# EAGLE design Color sensor_LED Board (EAGLE 9.6.2)
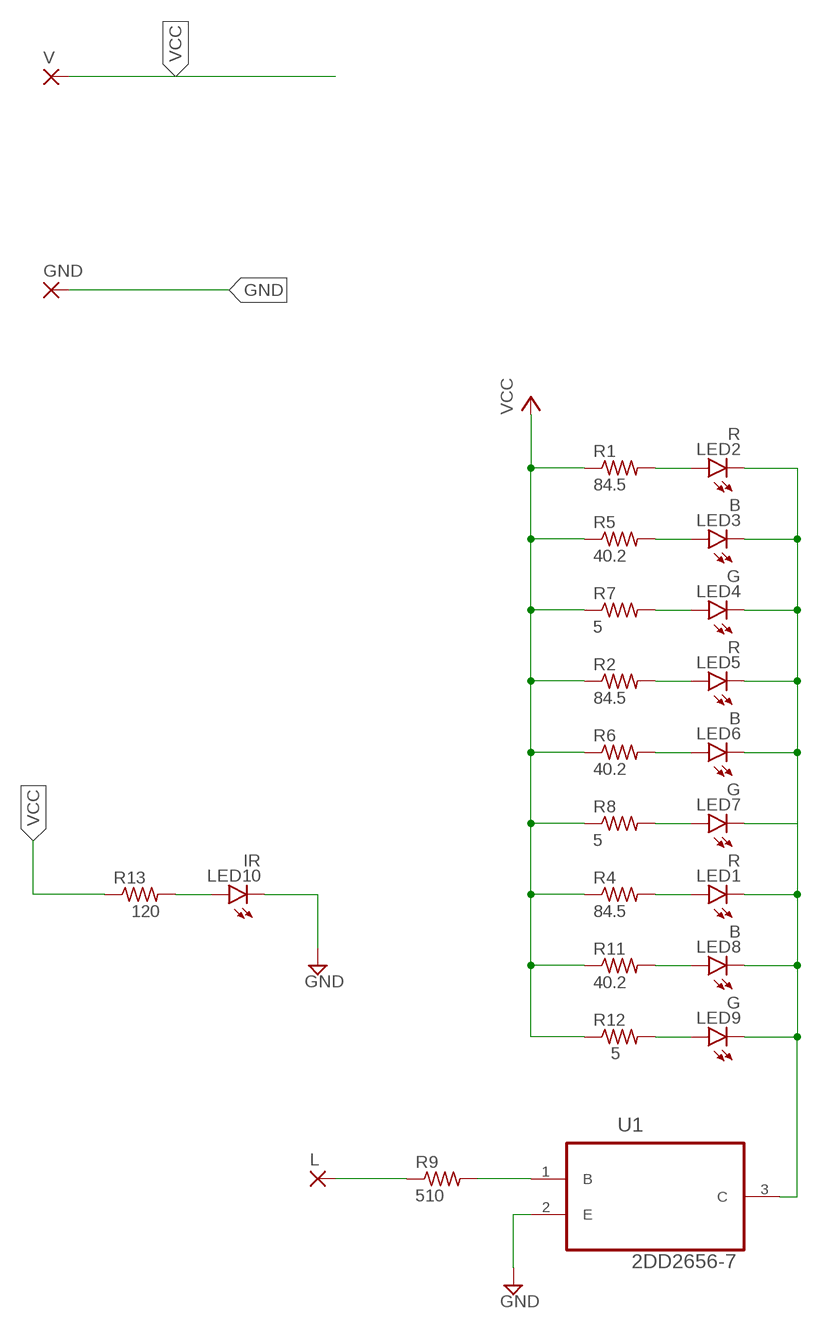
[diagram p0: schematic, sheet 1]

## Parts
GND  SMD2  [SMD1,27-2,54]
L  SMD2  [SMD1,27-2,54]
LED1  R  LEDCHIPLED_0805  [CHIPLED_0805]
LED2  R  LEDCHIPLED_0805  [CHIPLED_0805]
LED3  B  LEDCHIPLED_0805  [CHIPLED_0805]
LED4  G  LEDCHIPLED_0805  [CHIPLED_0805]
LED5  R  LEDCHIPLED_0805  [CHIPLED_0805]
LED6  B  LEDCHIPLED_0805  [CHIPLED_0805]
LED7  G  LEDCHIPLED_0805  [CHIPLED_0805]
LED8  B  LEDCHIPLED_0805  [CHIPLED_0805]
LED9  G  LEDCHIPLED_0805  [CHIPLED_0805]
LED10  IR  LEDCHIPLED_0805  [CHIPLED_0805]
R1  84.5  R-US_R0805  [R0805]
R2  84.5  R-US_R0805  [R0805]
R4  84.5  R-US_R0805  [R0805]
R5  40.2  R-US_R0805  [R0805]
R6  40.2  R-US_R0805  [R0805]
R7  5  R-US_R0805  [R0805]
R8  5  R-US_R0805  [R0805]
R9  510  R-US_R0805  [R0805]
R11  40.2  R-US_R0805  [R0805]
R12  5  R-US_R0805  [R0805]
R13  120  R-US_R0805  [R0805]
U1  2DD2656-7  [SOT65P210X110-3N]
V  SMD2  [SMD1,27-2,54]

## Nets
GND: GND.1(P) LED10.C U1.2(E)
N$2: R9.2 U1.1(B)
N$4: L.1(P) R9.1
N$6: LED2.A R1.2
N$7: LED3.A R5.2
N$8: LED4.A R7.2
N$9: LED5.A R2.2
N$10: LED6.A R6.2
N$11: LED7.A R8.2
N$12: LED1.A R4.2
N$13: LED8.A R11.2
N$14: LED9.A R12.2
N$15: LED1.C LED2.C LED3.C LED4.C LED5.C LED6.C LED7.C LED8.C LED9.C U1.3(C)
N$17: LED10.A R13.2
VCC: R1.1 R2.1 R4.1 R5.1 R6.1 R7.1 R8.1 R11.1 R12.1 R13.1 V.1(P)

## Library data of the parts
GND L V = wirepad:SMD2: SMD PAD
LED1-LED10 = led:LED: LED OSRAM: - CHIPLED LG R971, LG N971, LY N971, LG Q971, LY Q971, LO R971, LY R971 LH N974, LH R974 LS Q976, LO Q976, LY Q976 LO Q996 - Hyper CHIPLED LW Q18S LB Q993, LB Q99A, LB R99A - SideLED LS A670, LO A670, LY A670, LG A670, LP A670 LB A673, LV A673, LT A673, LW A673 LH A674 LY A675 LS A676, LA A676, LO A676, LY A676, LW A676 LS A679, LY A679, LG A679 - Hyper Micro SIDELED® LS Y876, LA Y876, LO Y876, LY Y876 LT Y87S - SmartLED LW L88C, LW L88S LB L89C, LB L89S, LG L890 LS L89K, LO L89K, LY L89K LS L896, LA L896, LO L896, LY L896 - TOPLED LS T670, LO T670, LY T670, LG T670, LP T670 LSG T670, LSP T670, LSY T670, LOP T670, LYG T670 LG T671, LOG T671, LSG T671 LB T673, LV T673, LT T673, LW T673 LH T674 LS T676, LA T676, LO T676, LY T676, LB T676, LH T676, LSB T676, LW T676 LB T67C, LV T67C, LT T67C, LS T67K, LO T67K, LY T67K, LW E67C LS E67B, LA E67B, LO E67B, LY E67B, LB E67C, LV E67C, LT E67C LW T67C LS T679, LY T679, LG T679 LS T770, LO T770, LY T770, LG T770, LP T770 LB T773, LV T773, LT T773, LW T773 LH T774 LS E675, LA E675, LY E675, LS T675 LS T776, LA T776, LO T776, LY T776, LB T776 LHGB T686 LT T68C, LB T68C - Hyper Mini TOPLED® LB M676 - Mini TOPLED Santana® LG M470 LS M47K, LO M47K, LY M47K Source: http://www.osram.convergy.de LUXEON: - LUMILED® LXK2-PW12-R00, LXK2-PW12-S00, LXK2-PW14-U00, LXK2-PW14-V00 LXK2-PM12-R00, LXK2-PM12-S00, LXK2-PM14-U00 LXK2-PE12-Q00, LXK2-PE12-R00, LXK2-PE12-S00, LXK2-PE14-T00, LXK2-PE14-U00 LXK2-PB12-K00, LXK2-PB12-L00, LXK2-PB12-M00, LXK2-PB14-N00, LXK2-PB14-P00, LXK2-PB14-Q00 LXK2-PR12-L00, LXK2-PR12-M00, LXK2-PR14-Q00, LXK2-PR14-R00 LXK2-PD12-Q00, LXK2-PD12-R00, LXK2-PD12-S00 LXK2-PH12-R00, LXK2-PH12-S00 LXK2-PL12-P00, LXK2-PL12-Q00, LXK2-PL12-R00 Source: www.luxeon.com KINGBRIGHT: KA-3528ASYC Source: www.kingbright.com
R1 R2 R4-R9 R11-R13 = rcl:R-US_: RESISTOR, American symbol; SPICEPREFIX: R
U1 = 2DD2656-7 (1):2DD2656-7: N-CHANNEL ENHANCEMENT MODE MOSFET Check prices <https://pricing.snapeda.com/parts/2DD2656-7/Diodes%20Zetex/view-part?ref=eda>; AVAILABILITY: Not in stock; DESCRIPTION: Trans GP BJT NPN 30V 1A 500mW 3-Pin SOT-323 T/R; MF: Diodes Zetex; MP: 2DD2656-7; PACKAGE: None; PRICE: None

## Board
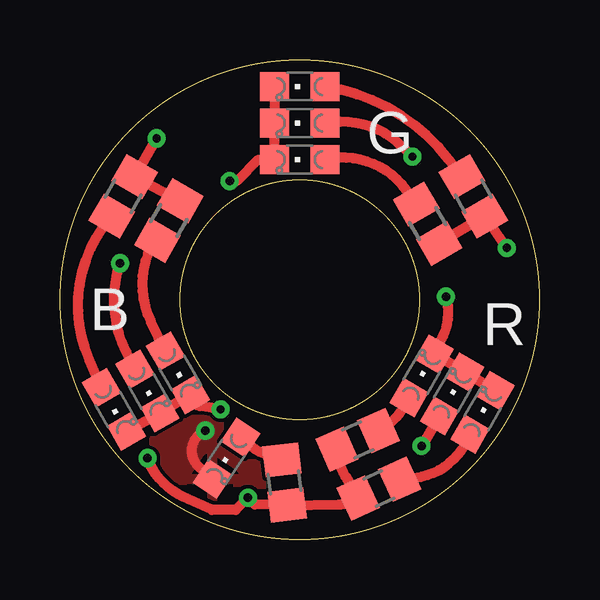
[diagram p1: board, top side]
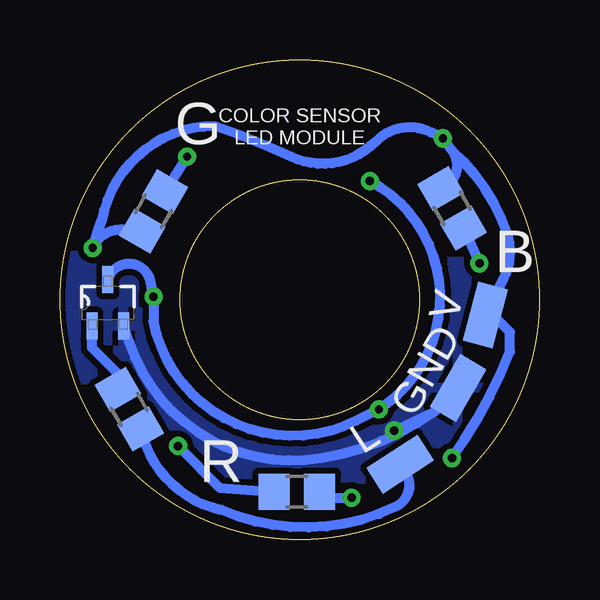
[diagram p2: board, bottom side, seen from below]

Size 20 x 20 mm. Coordinates in mm from the lower left corner, seen from the top.
Outline: circle at 10,10 radius 5
Outline: circle at 10,10 radius 10
Copper layers (1*16): Top 0.035mm / dielectric 1.5mm / Bottom 0.035mm
Design rules "default *": minimum track width 6mil, minimum drill 0.35mm, track to track 6mil, track to pad 8mil, pad to pad 6mil, via to via 10mil, smd to smd 6mil, copper to edge 8mil, drill to drill 6mil, minimum pad ring 10mil, minimum via ring 8mil, stop-mask expansion 4mil, vias tented up to drill 0mil, thermal gap 10mil

### Footprints (pad centres in the part's own frame; a part is rotated, then mirrored left to right if it is on the bottom)
SMD1,27-2,54 = smd 1.27 x 2.54: 1 0,0
CHIPLED_0805 = smd 1.2 x 1.2: A 0,-1.05; C 0,1.05
R0805 = smd 1.3 x 1.5: 1 -0.95,0; 2 0.95,0
SOT65P210X110-3N = smd 1.118 x 0.457: 1 -0.965,0.66; 2 -0.965,-0.66; 3 0.965,0

### Placement (x,y rotation side)
GND  3.4,6.32 330 bottom
L  5.81,3.14 303.1 bottom
LED1  15.08,6.83 330 top
LED2  17.62,5.3 330 top
LED3  4.92,6.95 210 top
LED4  10,15.84 90 top
LED5  16.35,6.06 330 top
LED6  2.25,5.43 210 top
LED7  10,17.37 90 top
LED8  3.65,6.19 210 top
LED9  10,18.89 90 top
LED10  6.95,3.4 146.2 top
R1  13.3,2.13 24.3 top
R2  10.13,2 180 bottom
R4  12.41,4.16 23.8 top
R5  4.54,13.3 240 top
R6  2.63,14.32 240 top
R7  15.33,13.18 120 top
R8  16.1,13.68 60 bottom
R9  17.11,5.43 120 bottom
R11  3.65,13.81 300 bottom
R12  17.24,14.32 120 top
R13  9.37,2.38 96.7 top
U1  18,9.87 90 bottom
V  2.25,9.37 345.4 bottom

### Tracks (layer width: path | path; a pad name or v marks a point on that pad's centre or on a via)
GND  (via drill 0.35)
  Top 0.406: LED10.C 5.81,3.01 arc-116 v6.06,4.54
  Bottom 0.406: U1.2 17.11,8.22 arc-81 9.11,3.4 arc-26 4.36,5.35 | GND.1 4.36,5.35 | v6.06,4.54 4.36,5.35
  pour Top: -0.67,9.87 arc-158 20.03,13.94 arc-126 7.46,-0.67 arc-77
  pour Bottom (isolate 0.254): -0.67,9.62 -0.67,10.25 arc-97 11.02,20.67 arc-89 20.8,8.48 arc-82 10.63,-1.05 arc-91
N$2
  Bottom 0.406: R9.2 17.59,6.92 18.66,7.99 U1.1
N$4
  Bottom 0.406: R9.1 16.54,4.28 arc-61 13.29,1.24 arc-50 6,1.37 arc-98 5.6,2.83 L.1
N$6
  Top 0.406: R1.2 15.08,2.62 arc57 LED2.A
N$7
  Top 0.406: LED3.A 3.78,9.11 arc-53 3.81,12.22 R5.2
N$8
  Top 0.406: R7.2 14.45,14.57 arc67 LED4.A
N$9  (via drill 0.35)
  Top 0.406: LED5.A v15.09,3.91 arc-51 v15.08,3.9
  Bottom 0.406: v15.08,3.9 13.34,2.17 R2.2
N$10
  Top 0.406: LED6.A 1.24,7.46 arc-65 R6.2
N$11  (via drill 0.35)
  Top 0.406: v14.7,15.97 14.32,16.35 arc55 LED7.A
  Bottom 0.406: R8.2 v14.7,15.97
N$12
  Top 0.406: R4.2 13.65,4.76 arc26 LED1.A
N$13  (via drill 0.35)
  Top 0.406: LED8.A 2.76,7.84 arc-44 v2.51,11.52
  Bottom 0.406: R11.2 v2.51,11.52
N$14
  Top 0.406: R12.2 16.22,15.84 arc44 LED9.A
N$15  (via drill 0.35)
  Top 0.406: LED6.C LED8.C LED3.C arc81 5.84,5.57 v6.7,5.43 | LED9.C LED7.C LED4.C 8.27,15.84 7.38,14.95 v7.08,14.95 | LED2.C LED5.C LED1.C 15.97,8.48 arc43 v16.1,10.13
  Bottom 0.406: U1.3 arc152 16.22,10.76 v16.1,10.13 16.1,9.11 arc-106 7.65,4.95 v6.7,5.43 6.34,5.7 arc-115 v7.08,14.95
N$17
  Top 0.406: R13.2 8.6,3.52 arc-23 LED10.A
VCC  (via drill 0.35)
  Top 0.406: R7.1 R12.1 v18.64,12.16 | v4.03,16.73 R6.1 | v3.65,3.4 arc49 5.36,1.69 6.34,1.24 7.33,1.24 v7.84,1.74 8.12,1.46 R13.1 11.62,1.46 arc36 R1.1 | R1.1 12.22,1.97 | R4.1 arc26 11.9,2.63 R1.1 | R6.1 | R6.1 R5.1 | R1.1 12.19,2.15
  Bottom 0.406: R8.1 17.37,12.92 arc-71 v18.64,12.16 18.26,13.3 arc80 13.56,17.24 arc7 10.38,15.97 arc-71 6.83,16.6 arc72 4.54,16.98 v4.03,16.73 3.65,16.22 | R2.1 8.92,1.74 v7.84,1.74 | 3.65,16.22 arc107 R11.1 | V.1 2.15,9.57 | 2.15,9.57 1.49,10.89 arc-46 1.36,12.79 arc-30 3.65,16.22 | v3.65,3.4 3.14,4.16 arc-13 1.24,7.84 1.24,8.65 2.15,9.57

### Text on the board
tNames: G | B | R
bNames: COLOR SENSOR / LED MODULE | G | B | R